# EAGLE design zegarek_v1.1 (EAGLE 6.2)
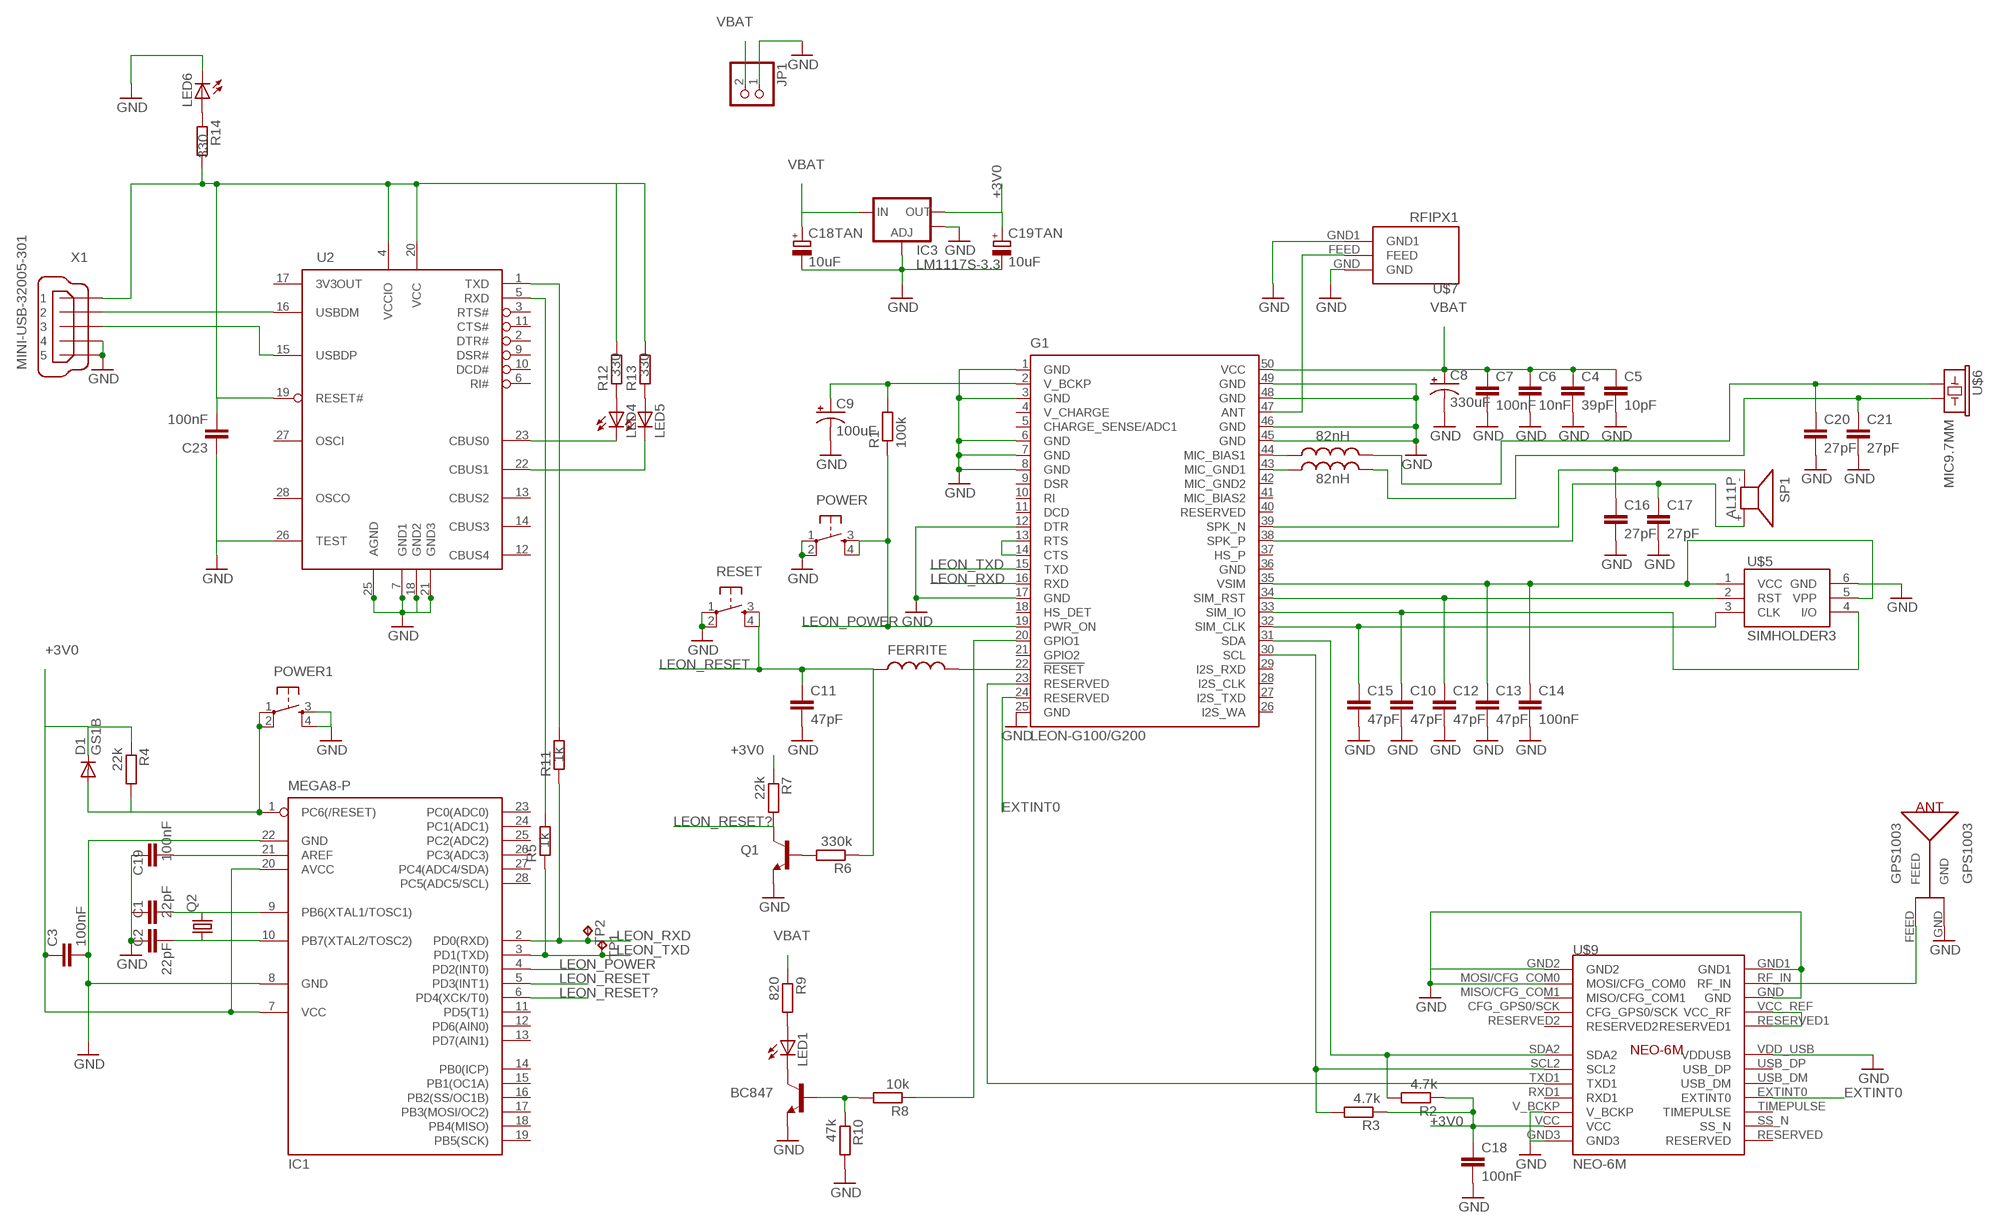
[diagram p0: schematic, sheet 1]

## Parts
BC847  TRANSISTOR_NPNSOT23  [SOT23]
C1  22pF  C-EUC0805  [C0805]
C2  22pF  C-EUC0805  [C0805]
C3  100nF  C-EUC0805  [C0805]
C4  39pF  C-EUC0805  [C0805]
C5  10pF  C-EUC0805  [C0805]
C6  10nF  C-EUC0805  [C0805]
C7  100nF  C-EUC0805  [C0805]
C8  330uF  CPOL-USUD-6,3X5,8  [UD-6,3X5,8_NICHICON]
C9  100uF  CPOL-USUD-6,3X5,8  [UD-6,3X5,8_NICHICON]
C10  47pF  C-EUC0805  [C0805]
C11  47pF  C-EUC0805  [C0805]
C12  47pF  C-EUC0805  [C0805]
C13  47pF  C-EUC0805  [C0805]
C14  100nF  C-EUC0805  [C0805]
C15  47pF  C-EUC0805  [C0805]
C16  27pF  C-EUC0805  [C0805]
C17  27pF  C-EUC0805  [C0805]
C18  100nF  C-EUC0805  [C0805]
C18TAN  10uF  CPOL-EUSMCA  [SMC_A]
C19  100nF  C-EUC0805  [C0805]
C19TAN  10uF  CPOL-EUSMCA  [SMC_A]
C20  27pF  C-EUC0805  [C0805]
C21  27pF  C-EUC0805  [C0805]
C23  100nF  C-EUC0805  [C0805]
D1  GS1B  DIODE-DO214AC  [DO214AC]
FERRITE  INDUCTOR0805  [0805]
FERRITE1  82nH  INDUCTOR0805  [0805]
FERRITE2  82nH  INDUCTOR0805  [0805]
G1  LEON-G100/G200  [LEON-G100/G200]
GPS1003  GPS1003  [GPS1003]
IC1  MEGA8-P  [DIL28-3]
IC3  LM1117S-3.3  V_REG_LM1117SOT223  [SOT223]
JP1  PINHD-1X2  [1X02]
LED1  LEDSMT1206  [1206]
LED4  LEDSMT1206  [1206]
LED5  LEDSMT1206  [1206]
LED6  LEDSMT1206  [1206]
POWER  TAC_SWITCHSMD  [TACTILE_SWITCH_SMD]
POWER1  TAC_SWITCHSMD  [TACTILE_SWITCH_SMD]
Q1  TRANSISTOR_NPNSOT23  [SOT23]
Q2  CRYSTALHC49S  [HC49/S]
R1  100k  R-EU_R0805  [R0805]
R2  4.7k  R-EU_R0805  [R0805]
R3  4.7k  R-EU_R0805  [R0805]
R4  22k  R-EU_R0805  [R0805]
R5  1k  R-EU_R0805  [R0805]
R6  330k  R-EU_R0805  [R0805]
R7  22k  R-EU_R0805  [R0805]
R8  10k  R-EU_R0805  [R0805]
R9  820  R-EU_R0805  [R0805]
R10  47k  R-EU_R0805  [R0805]
R11  1k  R-EU_R0805  [R0805]
R12  330  R-EU_R0805  [R0805]
R13  330  R-EU_R0805  [R0805]
R14  330  R-EU_R0805  [R0805]
RESET  TAC_SWITCHSMD  [TACTILE_SWITCH_SMD]
SP1  AL11P  [AL11P]
TP1  TPTP13R  [TP13R]
TP2  TPTP13R  [TP13R]
U2  FT232RL  [SSOP28DB]
U$5  SIMHOLDER3  [SIMHOLDER3]
U$6  MIC9.7MM  [MIC-9.7MM]
U$7  RFIPX1  [RF-IPX1]
U$9  NEO-6M  [NEO-6M]
X1  MINI-USB-32005-301  [32005-301]

## Nets
+3V0: C3.1 C18.1 C19TAN.+ D1.C IC1.7(VCC) IC1.20(AVCC) IC3.2(OUT) R2.1 R3.1 R4.1 R7.1 U$9.VCC
EXTINT0: G1.24(RESERVED) U$9.EXTINT0
GND: BC847.2(E) C1.1 C2.1 C3.2 C4.2 C5.2 C6.2 C7.2 C8.- C9.- C10.2 C11.2 C12.2 C13.2 C14.2 C15.2 C16.2 C17.2 C18.2 C18TAN.- C19.2 C19TAN.- C20.2 C21.2 C23.1 G1.1(GND) G1.3(GND) G1.6(GND) G1.7(GND) G1.8(GND) G1.12(DTR) G1.17(GND) G1.25(GND) G1.45(GND) G1.46(GND) G1.48(GND) G1.49(GND) GPS1003.GND IC1.8(GND) IC1.22(GND) IC3.1(ADJ) IC3.4(OUT) JP1.1 LED6.C POWER1.3 POWER1.4 POWER.1 POWER.2 Q1.2(E) R10.2 RESET.1 RESET.2 U2.7(GND1) U2.18(GND2) U2.21(GND3) U2.25(AGND) U2.26(TEST) U$5.6(GND) U$7.GND U$7.GND1 U$9.GND U$9.GND1 U$9.GND2 U$9.GND3 U$9.MOSI/CFG_COM0 U$9.V_BCKP U$9.VDD_USB(VDDUSB) X1.4 X1.5
LEON_POWER: G1.19(PWR_ON) IC1.4(PD2(INT0)) POWER.3 POWER.4 R1.1
LEON_RESET: C11.1 FERRITE.1 IC1.5(PD3(INT1)) R6.1 RESET.3 RESET.4
LEON_RESET?: IC1.6(PD4(XCK/T0)) Q1.3(C) R7.2
LEON_RXD: G1.16(RXD) IC1.2(PD0(RXD)) R11.1 TP2.TP
LEON_TXD: G1.15(TXD) IC1.3(PD1(TXD)) R5.1 TP1.TP
N$1: FERRITE.2 G1.22(!RESET)
N$2: C1.2 IC1.9(PB6(XTAL1/TOSC1)) Q2.2
N$3: C9.+ G1.2(V_BCKP) R1.2
N$4: C13.1 C14.1 G1.35(VSIM) U$5.1(VCC) U$5.5(VPP)
N$5: C15.1 G1.32(SIM_CLK) U$5.3(CLK)
N$6: C12.1 G1.34(SIM_RST) U$5.2(RST)
N$7: C16.1 G1.39(SPK_N) SP1.-
N$8: C10.1 G1.33(SIM_IO) U$5.4(I/O)
N$9: C17.1 G1.38(SPK_P) SP1.+
N$10: G1.13(RTS) G1.14(CTS)
N$11: FERRITE1.1 G1.44(MIC_BIAS1)
N$12: FERRITE2.1 G1.43(MIC_GND1)
N$13: C20.1 FERRITE1.2 U$6.1
N$14: C21.1 FERRITE2.2 U$6.2
N$15: Q1.1(B) R6.2
N$16: BC847.1(B) R8.2 R10.1
N$17: LED1.A R9.2
N$18: BC847.3(C) LED1.C
N$19: G1.20(GPIO1) R8.1
N$20: G1.47(ANT) U$7.FEED
N$21: C2.2 IC1.10(PB7(XTAL2/TOSC2)) Q2.1
N$23: GPS1003.FEED U$9.RF_IN
N$24: G1.31(SDA) R2.2 U$9.SDA2
N$25: U$9.RESERVED1 U$9.VCC_REF(VCC_RF)
N$26: G1.30(SCL) R3.2 U$9.SCL2
N$27: G1.23(RESERVED) U$9.TXD1
N$29: D1.A IC1.1(PC6(/RESET)) POWER1.1 POWER1.2 R4.2
N$30: C19.1 IC1.21(AREF)
N$31: LED4.A R12.1
N$32: LED5.A R13.1
N$33: LED4.C U2.23(CBUS0)
N$34: LED5.C U2.22(CBUS1)
N$35: R11.2 U2.1(TXD)
N$36: R5.2 U2.5(RXD)
N$47: C23.2 R12.2 R13.2 R14.2 U2.4(VCCIO) U2.19(RESET#) U2.20(VCC) X1.1
N$48: U2.16(USBDM) X1.2
N$49: U2.15(USBDP) X1.3
N$51: LED6.A R14.1
VBAT: C4.1 C5.1 C6.1 C7.1 C8.+ C18TAN.+ G1.50(VCC) IC3.3(IN) JP1.2 R9.1
Unconnected: G1.4(V_CHARGE) G1.5(CHARGE_SENSE/ADC1) G1.9(DSR) G1.10(RI) G1.11(DCD) G1.18(HS_DET) G1.21(GPIO2) G1.26(I2S_WA) G1.27(I2S_TXD) G1.28(I2S_CLK) G1.29(I2S_RXD) G1.37(HS_P) G1.40(RESERVED) G1.41(MIC_BIAS2) G1.42(MIC_GND2) IC1.11(PD5(T1)) IC1.12(PD6(AIN0)) IC1.13(PD7(AIN1)) IC1.14(PB0(ICP)) IC1.15(PB1(OC1A)) IC1.16(PB2(SS/OC1B)) IC1.17(PB3(MOSI/OC2)) IC1.18(PB4(MISO)) IC1.19(PB5(SCK)) IC1.23(PC0(ADC0)) IC1.24(PC1(ADC1)) IC1.25(PC2(ADC2)) IC1.26(PC3(ADC3)) IC1.27(PC4(ADC4/SDA)) IC1.28(PC5(ADC5/SCL)) U2.2(DTR#) U2.3(RTS#) U2.6(RI#) U2.9(DSR#) U2.10(DCD#) U2.11(CTS#) U2.12(CBUS4) U2.13(CBUS2) U2.14(CBUS3) U2.17(3V3OUT) U2.27(OSCI) U2.28(OSCO) U$9.CFG_GPS0/SCK U$9.MISO/CFG_COM1 U$9.RESERVED U$9.RESERVED2 U$9.RXD1 U$9.SS_N U$9.TIMEPULSE U$9.USB_DM U$9.USB_DP

## Power pins joined to a net without a drawn wire
GND: G1.36(GND)

## Library data of the parts
BC847 Q1 = SparkFun:TRANSISTOR_NPN: Transistor NPN BJT configuration in SOT23 package. MMBT2222 is the common NPN we use. Double check BCE configuration again layout.
C1-C7 C10-C21 C23 = rcl:C-EU: CAPACITOR, European symbol
C8 C9 = rcl:CPOL-US: POLARIZED CAPACITOR, American symbol
C18TAN C19TAN = rcl:CPOL-EU: POLARIZED CAPACITOR, European symbol
D1 = diode:DIODE-: DIODE
FERRITE FERRITE1 FERRITE2 = SparkFun:INDUCTOR: Inductors Basic Inductor/Choke - 0603 and 1206. Footprints are not proven and vary greatly between part numbers.
G1 = u-blox-1:LEON-G100/G200: LEON-G100/G200 Quad Band GSM/GPRS Voice and Data Modules Source: http://www.u-blox.com; OC_FARNELL: unknown; OC_NEWARK: unknown
GPS1003 = u-blox_NEO-6M:GPS1003
IC1 = atmel:MEGA8-P: MICROCONTROLLER 8 Kbytes FLASH, 1 kbytes SRAM, 512 bytes EEPROM, USART, 4-channel 10 bit ADC, 2-channel 8 bit ADC Pin compatible with Atmega48, ATMega88, ATMega168 Source: avr.lbr; OC_FARNELL: unknown; OC_NEWARK: unknown
IC3 = SparkFun:V_REG_LM1117: Voltage Regulator LM1117 Standard adjustable voltage regulator but in SMD form. Spark Fun Electronics SKU : COM-00595
JP1 = pinhead:PINHD-1X2: PIN HEADER
LED1 LED4-LED6 = led:LED: LED OSRAM: - CHIPLED LG R971, LG N971, LY N971, LG Q971, LY Q971, LO R971, LY R971 LH N974, LH R974 LS Q976, LO Q976, LY Q976 LO Q996 - Hyper CHIPLED LW Q18S LB Q993, LB Q99A, LB R99A - SideLED LS A670, LO A670, LY A670, LG A670, LP A670 LB A673, LV A673, LT A673, LW A673 LH A674 LY A675 LS A676, LA A676, LO A676, LY A676, LW A676 LS A679, LY A679, LG A679 - Hyper Micro SIDELED® LS Y876, LA Y876, LO Y876, LY Y876 LT Y87S - SmartLED LW L88C, LW L88S LB L89C, LB L89S, LG L890 LS L89K, LO L89K, LY L89K LS L896, LA L896, LO L896, LY L896 - TOPLED LS T670, LO T670, LY T670, LG T670, LP T670 LSG T670, LSP T670, LSY T670, LOP T670, LYG T670 LG T671, LOG T671, LSG T671 LB T673, LV T673, LT T673, LW T673 LH T674 LS T676, LA T676, LO T676, LY T676, LB T676, LH T676, LSB T676, LW T676 LB T67C, LV T67C, LT T67C, LS T67K, LO T67K, LY T67K, LW E67C LS E67B, LA E67B, LO E67B, LY E67B, LB E67C, LV E67C, LT E67C LW T67C LS T679, LY T679, LG T679 LS T770, LO T770, LY T770, LG T770, LP T770 LB T773, LV T773, LT T773, LW T773 LH T774 LS E675, LA E675, LY E675, LS T675 LS T776, LA T776, LO T776, LY T776, LB T776 LHGB T686 LT T68C, LB T68C - Hyper Mini TOPLED® LB M676 - Mini TOPLED Santana® LG M470 LS M47K, LO M47K, LY M47K Source: http://www.osram.convergy.de LUXEON: - LUMILED® LXK2-PW12-R00, LXK2-PW12-S00, LXK2-PW14-U00, LXK2-PW14-V00 LXK2-PM12-R00, LXK2-PM12-S00, LXK2-PM14-U00 LXK2-PE12-Q00, LXK2-PE12-R00, LXK2-PE12-S00, LXK2-PE14-T00, LXK2-PE14-U00 LXK2-PB12-K00, LXK2-PB12-L00, LXK2-PB12-M00, LXK2-PB14-N00, LXK2-PB14-P00, LXK2-PB14-Q00 LXK2-PR12-L00, LXK2-PR12-M00, LXK2-PR14-Q00, LXK2-PR14-R00 LXK2-PD12-Q00, LXK2-PD12-R00, LXK2-PD12-S00 LXK2-PH12-R00, LXK2-PH12-S00 LXK2-PL12-P00, LXK2-PL12-Q00, LXK2-PL12-R00 Source: www.luxeon.com KINGBRIGHT: KA-3528ASYC Source: www.kingbright.com
POWER POWER1 RESET = SparkFun:TAC_SWITCH: Momentary Switch Button commonly used for reset or general input. Spark Fun Electronics SKU : COM-00097
Q2 = crystal:CRYSTAL: CRYSTAL; OC_FARNELL: 1667008; OC_NEWARK: unknown
R1-R14 = rcl:R-EU_: RESISTOR, European symbol
SP1 = buzzer:AL11P: SPEAKER Source: Buerklin; OC_FARNELL: unknown; OC_NEWARK: unknown
TP1 TP2 = testpad:TP: Test pad
U2 = ftdichip-5:FT232RL: USB UART 4th Generation USB UART (USB <-> Serial) Controller
U$5 = SparkFun:SIMHOLDER3
U$6 = SparkFun:MIC: Microphone Omni-directional electret microphone. 9.7mm standard diameter.
U$7 = RFIPX:RFIPX1
U$9 = u-blox_NEO-6M:NEO-6M
X1 = con-cypressindustries:MINI-USB-: MINI USB-B Conector Source: www.cypressindustries.com; OC_FARNELL: unknown; OC_NEWARK: unknown

## Net classes
0 default: width 0.203 mm

## Board
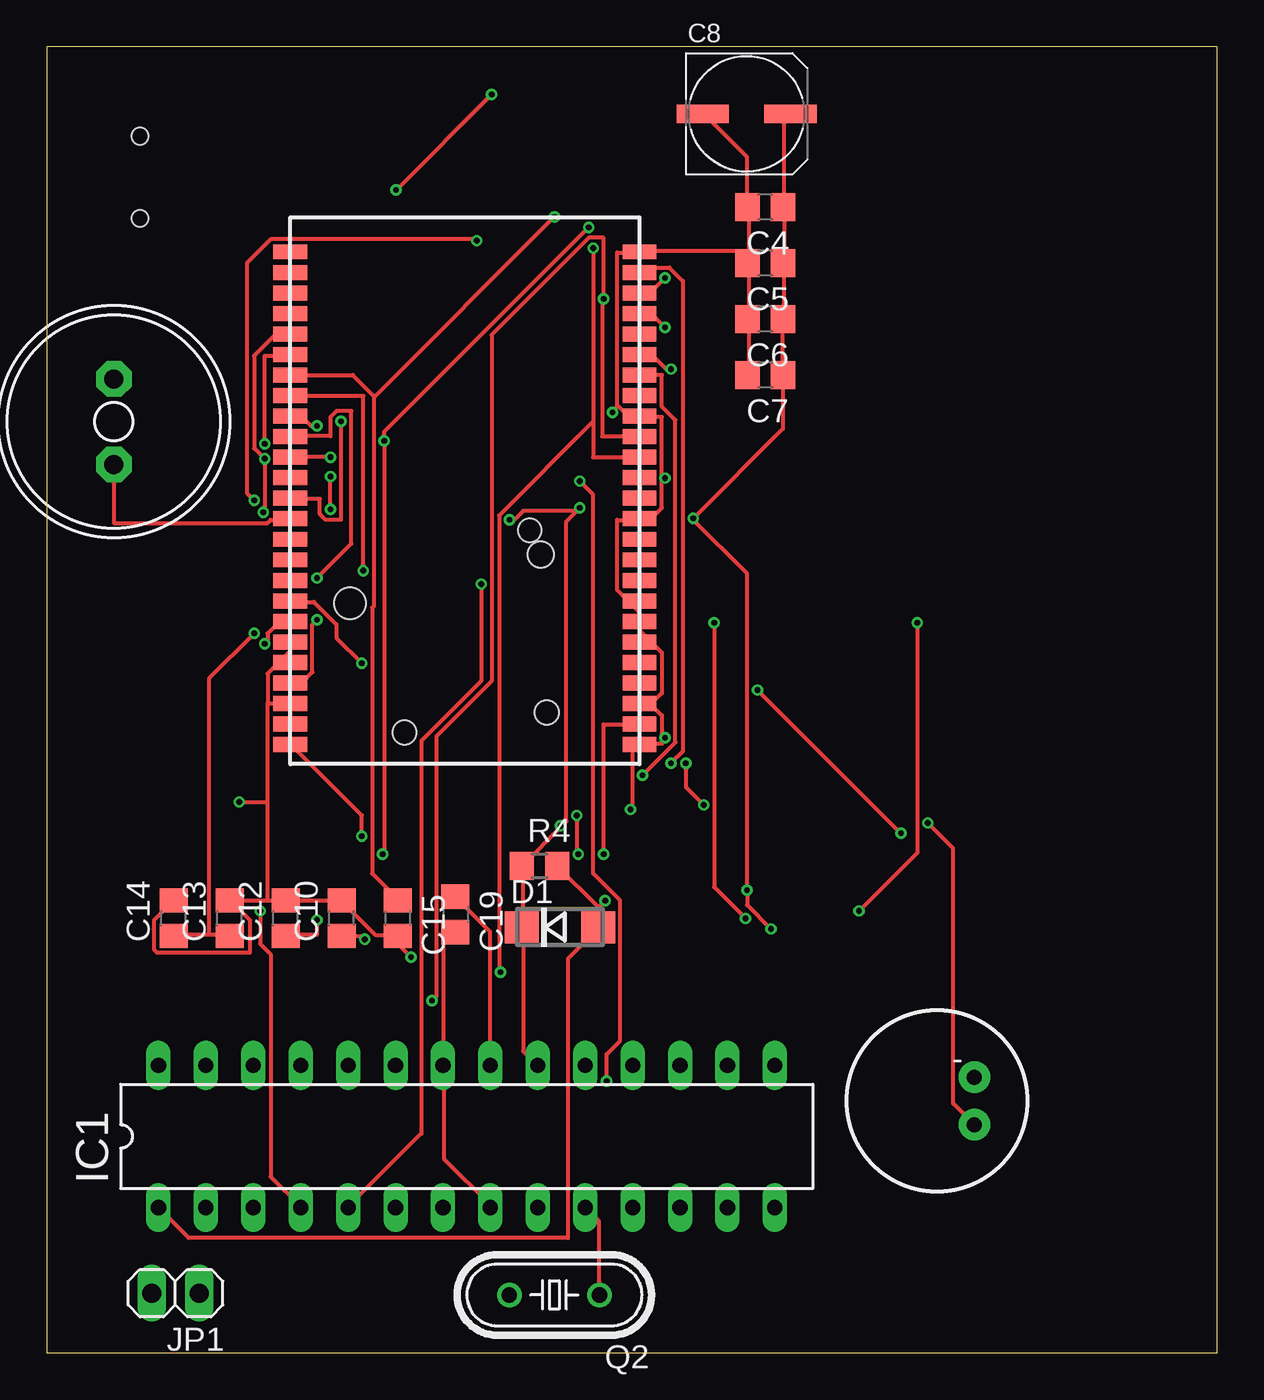
[diagram p1: board, top side]
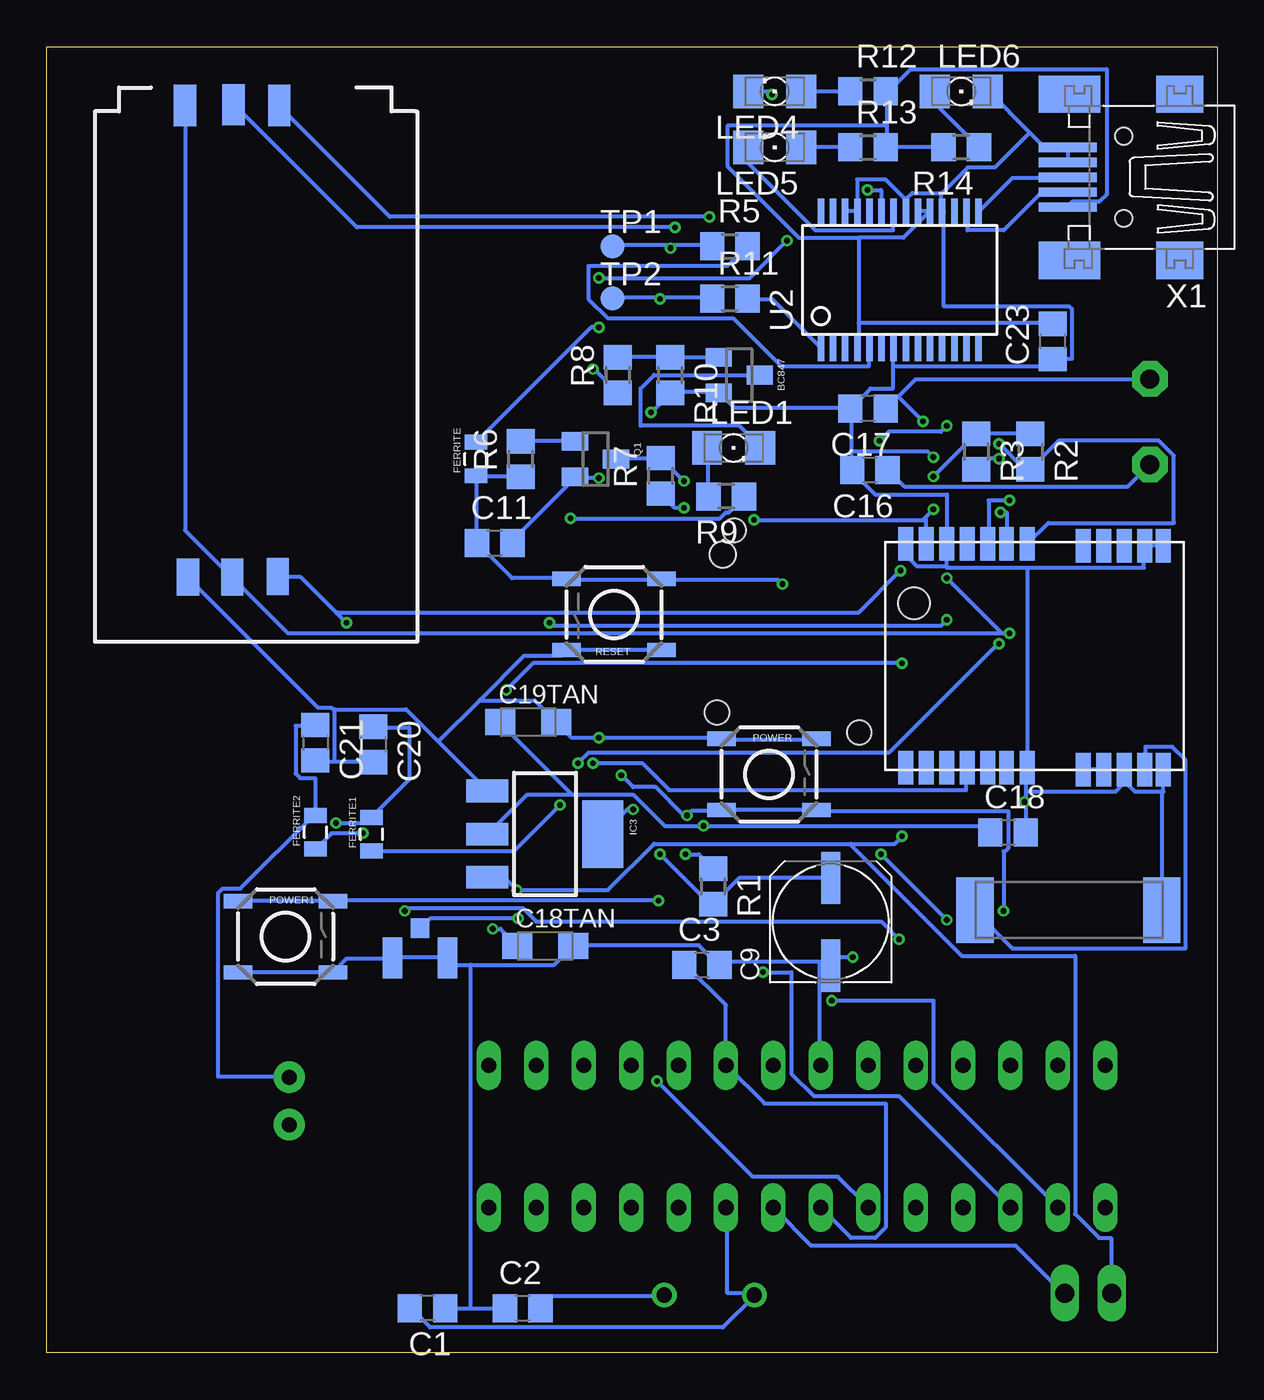
[diagram p2: board, bottom side, seen from below]

Size 62.7 x 70 mm. Coordinates in mm from the lower left corner, seen from the top.
Outline: 0,0 62.7,0 62.7,70 0,70 0,0
Copper layers (1*16): Top 0.035mm / dielectric 1.5mm / Bottom 0.035mm
Design rules: minimum track width 6mil, minimum drill 12mil, track to track 6mil, track to pad 6mil, pad to pad 6mil, via to via 6mil, smd to smd 0mil, copper to edge 10mil, drill to drill 10mil, minimum pad ring 10mil, minimum via ring 6mil, stop-mask expansion 2mil, vias tented up to drill 100mil, thermal gap 10mil

### Footprints (pad centres in the part's own frame; a part is rotated, then mirrored left to right if it is on the bottom)
SOT23 = smd 1 x 1.4: 1 -0.95,-1.1; 2 0.95,-1.1; 3 0,1.1
C0805 = smd 1.3 x 1.5: 1 -0.95,0; 2 0.95,0
UD-6,3X5,8_NICHICON = smd 2.8 x 1: + 2.35,0; - -2.35,0
SMC_A = smd 1.6 x 1.4: + -1.5,0; - 1.5,0
DO214AC = smd 1.8 x 1.7: A 2.05,0; C -2.05,0
0805 = smd 0.8 x 1.2: 1 -0.9,0; 2 0.9,0
LEON-G100/G200 = smd 1.8 x 0.8: 1 -9.35,13.6; 2 -9.35,12.5; 3 -9.35,11.4; 4 -9.35,10.3; 5 -9.35,9.2; 6 -9.35,8.1; 7 -9.35,7; 8 -9.35,5.9; 9 -9.35,4.8; 10 -9.35,3.7; 11 -9.35,2.6; 12 -9.35,1.5; 13 -9.35,0.4; 14 -9.35,-0.7; 15 -9.35,-1.8; 16 -9.35,-2.9; 17 -9.35,-4; 18 -9.35,-5.1; 19 -9.35,-6.2; 20 -9.35,-7.3; 21 -9.35,-8.4; 22 -9.35,-9.5; 23 -9.35,-10.6; 24 -9.35,-11.7; 25 -9.35,-12.8; 26 9.35,-12.8; 27 9.35,-11.7; 28 9.35,-10.6; 29 9.35,-9.5; 30 9.35,-8.4; 31 9.35,-7.3; 32 9.35,-6.2; 33 9.35,-5.1; 34 9.35,-4; 35 9.35,-2.9; 36 9.35,-1.8; 37 9.35,-0.7; 38 9.35,0.4; 39 9.35,1.5; 40 9.35,2.6; 41 9.35,3.7; 42 9.35,4.8; 43 9.35,5.9; 44 9.35,7; 45 9.35,8.1; 46 9.35,9.2; 47 9.35,10.3; 48 9.35,11.4; 49 9.35,12.5; 50 9.35,13.6 | hole 1.31: -4.39,11.88 | hole 1.29: 3.23,12.96 | hole 1.7: 6.16,6.02 | hole 1.4: -4.07,3.42 | hole 1.24: -3.47,2.12
GPS1003 = smd 3.5 x 2: FEED 0.23,4.96; GND 0.23,-5.04
DIL28-3 = drill 0.813 long: 1 -16.51,-3.81; 2 -13.97,-3.81; 3 -11.43,-3.81; 4 -8.89,-3.81; 5 -6.35,-3.81; 6 -3.81,-3.81; 7 -1.27,-3.81; 8 1.27,-3.81; 9 3.81,-3.81; 10 6.35,-3.81; 11 8.89,-3.81; 12 11.43,-3.81; 13 13.97,-3.81; 14 16.51,-3.81; 15 16.51,3.81; 16 13.97,3.81; 17 11.43,3.81; 18 8.89,3.81; 19 6.35,3.81; 20 3.81,3.81; 21 1.27,3.81; 22 -1.27,3.81; 23 -3.81,3.81; 24 -6.35,3.81; 25 -8.89,3.81; 26 -11.43,3.81; 27 -13.97,3.81; 28 -16.51,3.81
SOT223 = smd 1.219 x 2.235: 1 -2.311,-3.099; 2 0,-3.099; 3 2.311,-3.099 | smd 3.6 x 2.2: 4 0,3.099
1X02 = drill 1.016 long: 1 -1.27,0; 2 1.27,0
1206 = smd 1.6 x 1.803: A -1.422,0; C 1.422,0
TACTILE_SWITCH_SMD = smd 1.524 x 0.762: 1 -2.54,1.905; 2 2.54,1.905; 3 -2.54,-1.905; 4 2.54,-1.905
HC49/S = drill 0.813: 1 -2.413,0; 2 2.413,0
R0805 = smd 1.3 x 1.5: 1 -0.95,0; 2 0.95,0
AL11P = drill 1.016 pad 1.905 octagon: + 2.286,0; - -2.286,0
TP13R = smd 1.3 x 1.3: TP 0,0
SSOP28DB = smd 0.348 x 1.397: 1 -4.225,-3.656; 2 -3.575,-3.656; 3 -2.925,-3.656; 4 -2.275,-3.656; 5 -1.625,-3.656; 6 -0.975,-3.656; 7 -0.325,-3.656; 8 0.325,-3.656; 9 0.975,-3.656; 10 1.625,-3.656; 11 2.275,-3.656; 12 2.925,-3.656; 13 3.575,-3.656; 14 4.225,-3.656; 15 4.225,3.656; 16 3.575,3.656; 17 2.925,3.656; 18 2.275,3.656; 19 1.625,3.656; 20 0.975,3.656; 21 0.325,3.656; 22 -0.325,3.656; 23 -0.975,3.656; 24 -1.625,3.656; 25 -2.275,3.656; 26 -2.925,3.656; 27 -3.575,3.656; 28 -4.225,3.656
SIMHOLDER3 = smd 2.2 x 1.2: 1 0.95,4.81; 2 0.91,7.41; 3 0.95,9.86 | smd 2 x 1.2: 4 26.2,9.78; 5 26.22,7.34; 6 26.22,4.98
MIC-9.7MM = drill 0.8 pad 1.676: 1 -2,1.27; 2 -2,-1.27
RF-IPX1 = smd 1 x 1.05: FEED 0,-1.05 | smd 1.05 x 2.2: GND 1.475,0.525; GND1 -1.475,0.525
NEO-6M = smd 0.8 x 1.8: CFG_GPS0/SCK -3.32,-6.15; EXTINT0 3.98,5.75; GND -4.42,5.85; GND1 -6.52,5.85; GND2 -6.52,-6.15; GND3 7.28,-6.25; MISO/CFG_COM1 -4.42,-6.15; MOSI/CFG_COM0 -5.52,-6.15; RESERVED 7.28,5.75; RESERVED1 -2.22,5.85; RESERVED2 -2.22,-6.15; RF_IN -5.52,5.85; RXD1 3.98,-6.25; SCL2 1.88,-6.25; SDA2 0.78,-6.25; SS_N 6.18,5.75; TIMEPULSE 5.08,5.75; TXD1 2.88,-6.25; USB_DM 2.88,5.75; USB_DP 1.88,5.75; V_BCKP 5.08,-6.25; VCC 6.18,-6.25; VCC_REF -3.32,5.85; VDD_USB 0.78,5.75
32005-301 = smd 3.1 x 0.5: 1 3,1.6; 2 3,0.8; 3 3,0; 4 3,-0.8; 5 3,-1.6 | smd 2.5 x 2: M1 -3,-4.45; M2 -3,4.45 | smd 3.3 x 2: M3 2.9,4.45; M4 2.9,-4.45 | hole 0.9: 0,2.2; 0,-2.2

### Placement (x,y rotation side)
BC847  25.6,52.4 270 bottom
C1  42.3,2.4 180 bottom
C2  37.2,2.4 0 bottom
C3  27.6,20.8 0 bottom
C4  38.5,61.4 180 top
C5  38.5,58.4 180 top
C6  38.5,55.4 180 top
C7  38.5,52.4 180 top
C8  37.5,66.4 0 top
C9  20.7,23.1 90 bottom
C10  15.8,23.3 90 top
C11  38.7,43.4 0 bottom
C12  12.8,23.3 90 top
C13  9.8,23.3 90 top
C14  6.8,23.3 90 top
C15  18.8,23.3 270 top
C16  18.6,47.3 180 bottom
C17  18.7,50.6 180 bottom
C18  11.2,27.9 0 bottom
C18TAN  36,21.8 0 bottom
C19  21.9,23.5 270 top
C19TAN  36.9,33.8 0 bottom
C20  45.2,32.6 270 bottom
C21  48.3,32.7 270 bottom
C23  8.8,54.2 90 bottom
D1  27.5,22.8 0 top
FERRITE  39.7,47.9 90 bottom
FERRITE1  45.3,27.8 90 bottom
FERRITE2  48.3,27.9 90 bottom
G1  22.4,46.2 180 top
GPS1003  8,23.5 90 bottom
IC1  22.5,11.6 0 top
IC3  36,27.8 270 bottom
JP1  6.9,3.2 180 top
LED1  25.9,48.5 0 bottom
LED4  23.7,67.6 180 bottom
LED5  23.7,64.6 180 bottom
LED6  13.7,67.6 0 bottom
POWER  24,31 0 bottom
POWER1  49.9,22.3 0 bottom
Q1  33.3,47.9 270 bottom
Q2  27.2,3.1 180 top
R1  27,25 270 bottom
R2  10,48.3 270 bottom
R3  12.9,48.3 270 bottom
R4  26.4,26.1 0 top
R5  26.1,59.3 0 bottom
R6  37.3,47.9 90 bottom
R7  29.8,47 90 bottom
R8  32.1,52.4 90 bottom
R9  26.3,45.9 180 bottom
R10  29.3,52.4 270 bottom
R11  26.1,56.5 0 bottom
R12  18.7,67.6 0 bottom
R13  18.7,64.6 0 bottom
R14  13.7,64.6 180 bottom
RESET  32.3,39.57 180 bottom
SP1  3.6,49.9 90 top
TP1  32.4,59.3 0 bottom
TP2  32.4,56.5 0 bottom
U2  17,57.5 0 bottom
U$5  60.1,67.8 270 bottom
U$6  47.7,13.5 180 top
U$7  42.7,21.7 180 bottom
U$9  9.4,37.1 180 bottom
X1  5,63 180 bottom

### Tracks (layer width: path | path; a pad name or v marks a point on that pad's centre or on a via)
+3V0  (via drill 0.3)
  Top 0.203: 27.56,28.2 25.52,26.16 R4.1 25.52,26.08 25.52,22.8 D1.C 25.52,22.72 25.52,16.16 26.24,15.44 IC1.20 | 27.56,28.2 27.84,28.48 27.84,44.56 v28.56,45.28 28.32,45.12 25.52,45.12 25.04,44.64 v24.8,44.64 | v15.2,45.2 v15.2,46.96 | v27.52,28.24 27.56,28.2
  Bottom 0.203: 34.64,29.92 36.96,29.92 39.04,27.84 IC3.2 | 34.64,29.92 31.28,29.92 29.6,28.24 v27.52,28.24 12.48,28.24 12.16,27.92 C18.1 | C19TAN.+ 38.4,33.76 34.64,30 34.64,29.92 | C3.1 28.48,20.8 26.32,18.64 26.32,15.44 IC1.20 26.24,15.36 24.24,13.36 17.76,13.36 17.76,6.72 18.32,6.16 19.6,6.16 IC1.7 | R2.1 10,49.28 12.88,49.28 R3.1 12.96,49.2 v15.2,46.96 | v28.56,45.28 29.04,45.28 29.76,46 R7.1 | v24.8,44.64 15.68,44.64 | 15.68,44.64 15.6,44.64 15.6,43.36 U$9.VCC | v15.2,45.2 15.68,44.72 15.68,44.64
EXTINT0  (via drill 0.3)
  Top 0.203: v33.44,31.6 34.08,32.24 34.08,57.44 33.36,58.16 31.76,58.16 31.76,57.92 G1.24
  Bottom 0.203: v33.44,31.6 30.8,31.6 29.36,30.16 13.44,30.16 13.44,31.28 U$9.EXTINT0
GND  (via drill 0.3)
  Top 0.203: C7.2 37.6,52.4 37.6,55.36 C6.2 37.6,55.44 37.6,58.32 C5.2 | 31.76,59.04 G1.25 | C5.2 37.6,58.4 37.6,61.36 C4.2 37.52,61.44 37.52,64.08 35.2,66.4 C8.- | G1.25 31.84,59.04 37.52,59.04 C5.2 | 32.96,32.96 32.96,34.16 32.32,34.8 G1.3 32.4,34.8 32.96,35.36 32.96,37.52 31.84,38.64 31.76,38.64 | 32.96,32.96 32.96,32.64 31.76,32.64 G1.1 31.68,32.56 31.36,32.24 31.36,29.2 v31.28,29.12 | 31.76,50.24 G1.17 | 31.76,40.32 G1.8 31.76,40.24 31.76,39.76 | 31.76,38.08 G1.6 31.76,38.16 31.76,38.64 | 31.76,38.64 G1.7 31.76,39.28 31.76,39.76 | 31.76,39.76 31.68,39.76 30.56,40.88 30.56,44.64 31.68,44.64 G1.12 31.84,44.72 32.4,44.72 32.96,45.28 32.96,46.88 | 32.96,46.88 32.96,50.16 31.84,50.16 G1.17 | v33.12,46.88 32.96,46.88 | 30.56,50.8 30.56,58.96 31.68,58.96 G1.25 | 30.56,50.8 31.12,50.24 31.68,50.24 G1.17 | v33.12,32.96 32.96,32.96 | 23.76,7.84 IC1.8 23.76,7.92 21.28,10.4 21.28,15.36 IC1.22 21.28,15.44 21.28,21.92 21.84,22.48 C19.2 | G1.49 13.04,33.76 G1.48 11.84,34.8 | 13.04,37.04 G1.46 13.04,37.12 13.04,37.52 | 13.04,37.52 13.04,38.08 G1.45 | 11.84,34.8 11.84,36.4 12.96,37.52 13.04,37.52 | C14.2 5.76,23.2 5.76,21.6 5.92,21.44 10.88,21.44 10.88,23.2 9.84,24.24 C13.2 9.92,24.24 11.84,24.24 | 11.84,24.24 C12.2 12.88,24.24 15.76,24.24 C10.2 15.84,24.16 17.6,22.4 18.8,22.4 C15.2 18.88,22.32 18.88,21.84 v19.52,21.2 | 11.84,24.24 11.84,29.52 | 11.84,29.52 11.84,34.8 | v15.2,48 G1.36 | v10.32,29.52 11.84,29.52 | v30.32,50.4 30.32,50.48 30.56,50.72 30.56,50.8
  Bottom 0.203: POWER.2 21.52,32.88 26.48,32.88 POWER.1 26.56,32.96 v33.12,32.96 34.56,32.96 C19TAN.- 36.56,34.96 39.44,34.96 39.48,35 | RESET.1 29.84,37.68 34.8,37.68 RESET.2 34.88,37.6 35.12,37.36 37.12,37.36 39.48,35 | 47.28,31.68 48.24,31.68 C21.2 | 47.28,31.68 45.2,31.68 C20.2 | 47.32,34.44 47.28,34.4 47.28,31.68 | 47.32,34.44 47.44,34.56 48.16,34.56 55.12,41.52 U$5.6 | 41.72,32.76 43.44,34.48 47.28,34.48 47.32,34.44 | 41.72,32.76 39.12,30.16 IC3.1 | 41.72,32.76 39.48,35 | C11.2 37.68,43.44 37.68,43.6 34.4,46.88 Q1.2 34.32,46.88 v33.12,46.88 | v31.28,29.12 31.6,29.12 32.88,27.84 IC3.4 | POWER1.3 52.4,20.4 47.44,20.4 POWER1.4 46.64,21.12 44.24,21.12 U$7.GND 44.08,21.2 41.28,21.2 U$7.GND1 41.2,21.12 40.88,20.8 40,20.8 | C1.1 40,2.4 | 40,2.4 C2.1 | 40,20.8 35.52,20.8 34.56,21.76 C18TAN.- 34.48,21.84 27.76,21.84 26.72,20.8 C3.2 26.48,20.96 21.28,20.96 | 40,20.8 40,2.4 | 21.28,20.96 20.88,20.96 20.72,20.8 C9.- 20.64,20.8 20.24,21.2 v19.52,21.2 | JP1.1 8.24,3.2 10.8,5.76 21.76,5.76 23.76,7.76 IC1.8 | 21.28,20.96 21.28,15.44 IC1.22 | U2.26 19.92,61.2 19.28,61.2 U2.25 19.28,61.28 19.28,62.88 17.76,62.88 16.72,61.84 U2.21 16.64,61.2 16.64,61.84 16.32,62.16 14.8,62.16 | 14.8,62.16 14.8,61.2 U2.18 14.64,61.12 14.64,56.08 7.92,56.08 7.76,55.92 7.76,53.28 8.72,53.28 C23.1 8.8,53.2 9.12,52.88 17.36,52.88 | 10.04,65.4 9.28,64.64 8,64.64 X1.5 X1.4 | 10.04,65.4 12.24,67.6 LED6.C | 10.04,65.4 11.92,63.52 13.36,63.52 14.72,62.16 14.8,62.16 | U$9.GND1 2.88,30.08 2.96,30.08 | 2.96,30.08 4.4,30.08 4.96,30.64 4.96,31.2 U$9.GND 4.96,30.56 5.44,30.08 10.24,30.08 | 10.24,30.08 10.24,31.28 U$9.VDD_USB 10.16,31.44 10.16,42.08
  Bottom 0.203: 10.24,30.08 10.24,29.52 | 10.24,29.52 10.24,27.92 C18.2 | 2.96,30.08 GPS1003.GND | U$9.GND2 2.88,43.28 3.84,43.28 U$9.MOSI/CFG_COM0 3.92,43.2 3.92,42.08 10.16,42.08 | 14.48,42.16 U$9.V_BCKP 14.48,46 18.32,46 19.52,47.2 C16.2 19.6,47.36 19.6,48.32 | 14.48,42.16 16.08,42.16 16.64,42.72 16.64,43.28 U$9.GND3 | 10.16,42.08 14.48,42.08 14.48,42.16 | 17.36,52.88 17.36,51.68 18.56,51.68 19.6,50.64 C17.2 | 17.36,52.88 17.36,53.84 U2.7 | 19.6,48.32 19.6,50.56 C17.2 | v15.2,48 15.52,48.32 19.6,48.32 | C17.2 19.68,50.64 25.84,50.64 26.64,51.44 BC847.2 26.72,51.52 29.28,51.52 R10.2 29.28,51.36 29.36,51.36 v30.32,50.4 | v10.32,29.52 10.24,29.52
LEON_POWER  (via drill 0.3)
  Top 0.203: v28.48,26.72 28.4,26.8 v28.4,28.8 | G1.19 32.96,52.4 32.96,50.72 33.68,50 33.68,32.72 v31.92,30.96 | v11.44,23.68 11.44,21.92 12,21.36 12,9.44 13.6,7.84 IC1.4
  Bottom 0.203: v28.48,26.72 27.76,26.72 27.04,26 R1.1 | v31.92,30.96 31.28,30.32 30.08,30.32 28.56,28.8 v28.4,28.8 28.16,29.04 26.56,29.04 POWER.3 26.48,29.12 21.52,29.12 POWER.4 21.44,29.04 11.2,29.04 11.2,27.04 11.36,26.88 11.44,26.88 v11.44,23.68
LEON_RESET  (via drill 0.3)
  Top 0.203: v23.28,41.2 23.28,36 20.08,32.8 20.08,11.76 16.16,7.84 IC1.5
  Bottom 0.203: R6.1 37.36,46.96 39.68,46.96 FERRITE.1 39.68,46.88 39.68,43.44 C11.1 39.6,43.36 37.76,41.52 34.88,41.52 RESET.4 34.8,41.44 29.84,41.44 RESET.3 29.68,41.44 23.52,41.44 v23.28,41.2
LEON_RESET?  (via drill 0.3)
  Top 0.203: v28.56,46.72 29.28,46 29.28,25.68 30.72,24.24 30.72,16.72 30,16 v30,14.56
  Bottom 0.203: Q1.3 32.16,47.92 29.84,47.92 R7.2 29.76,47.92 v28.56,46.72 | v30,14.56 24.88,9.44 20.32,9.44 18.72,7.84 IC1.6
LEON_RXD  (via drill 0.3)
  Top 0.203: G1.16 31.68,49.12 29.76,49.12 29.76,56.4 v29.84,56.48 29.84,59.76 29.04,59.76 23.84,54.56 23.84,36 20.88,33.04 20.88,19.12 v20.64,18.88
  Bottom 0.203: 29.84,56.56 27.12,56.56 R11.1 | 29.84,56.56 32.4,56.56 TP2.TP | v29.84,56.48 29.84,56.56 | v20.64,18.88 15.2,18.88 15.2,14.48 8.56,7.84 IC1.2
LEON_TXD  (via drill 0.3)
  Top 0.203: G1.15 29.28,48 29.28,49.84 | v29.28,59.2 29.28,49.84 | v24.32,20.4 24.24,20.48 24.24,44.88 29.2,49.84 29.28,49.84
  Bottom 0.203: 29.28,59.36 27.12,59.36 R5.1 | 29.28,59.36 32.4,59.36 TP1.TP | v29.28,59.2 29.28,59.36 | IC1.3 17.04,13.76 21.6,13.76 22.8,14.96 22.8,20.4 v24.32,20.4
N$1  (via drill 0.3)
  Top 0.203: v33.12,54.96 32.4,55.68 31.76,55.68 G1.22
  Bottom 0.203: v33.12,54.96 33.52,54.96 39.68,48.8 FERRITE.2
N$2
  Bottom 0.203: C1.2 43.2,2.4 42.16,1.36 26.48,1.36 24.8,3.04 Q2.2 24.8,3.2 26.24,3.2 26.24,7.76 IC1.9
N$3  (via drill 0.3)
  Top 0.203: v29.84,26.72 29.84,33.68 31.68,33.68 G1.2
  Bottom 0.203: C9.+ 20.72,25.44 25.6,25.44 26.96,24.08 R1.2 27.04,24.08 27.2,24.08 v29.84,26.72
N$4  (via drill 0.3)
  Top 0.203: 8.72,22.4 9.76,22.4 C13.1 | 8.72,22.4 6.8,22.4 C14.1 | v14.48,41.52 16.32,43.36 16.32,50.48 15.52,50.48 15.2,50.16 15.2,49.12 13.12,49.12 G1.35 | v11.12,38.56 8.72,36.16 8.72,22.4
  Bottom 0.203: U$5.1 55.28,66.8 55.28,44.08 52.8,41.6 U$5.5 52.72,41.52 49.76,38.56 11.6,38.56 11.56,38.6 | 11.56,38.6 11.52,38.56 v11.12,38.56 | 11.56,38.6 v14.48,41.52
N$5  (via drill 0.3)
  Top 0.203: 17.52,51.28 17.52,40 17.44,39.92 17.44,25.68 18.8,24.32 C15.1 | 17.52,51.28 16.4,52.4 G1.32 | v27.2,60.88 17.6,51.28 17.52,51.28
  Bottom 0.203: v27.2,60.88 44.32,60.88 50.24,66.8 U$5.3
N$6  (via drill 0.3)
  Top 0.203: v14.48,23.2 14.48,22.4 12.8,22.4 C12.1 | v18,26.72 18.08,26.8 v18.08,48.88 18.08,49.36 v29.04,60.32 | v14.48,49.68 14.16,49.68 13.68,50.16 13.12,50.16 G1.34
  Bottom 0.203: v18,26.72 v14.48,23.2 | v18.08,48.88 17.6,49.36 14.8,49.36 v14.48,49.68 | v29.04,60.32 46.08,60.32 52.64,66.88 U$5.2
N$7
  Top 0.203: SP1.- 3.6,44.48 11.84,44.48 12,44.64 13.04,44.64 G1.39
  Bottom 0.203: C16.1 17.6,47.28 16.72,46.4 4.8,46.4 SP1.-
N$8  (via drill 0.3)
  Top 0.203: v17.04,22.16 17.04,22.32 15.84,22.32 C10.1 | v43.52,23.68 46.64,26.8 v46.64,39.12 | v16.96,41.92 16.96,51.28 13.12,51.28 G1.33
  Bottom 0.203: v17.04,22.16 18,23.12 36.48,23.12 37.2,23.84 43.36,23.84 v43.52,23.68 | 47.16,39.64 49.12,41.6 U$5.4 | 47.16,39.64 v46.64,39.12 | v16.96,41.92 19.2,39.68 47.12,39.68 47.16,39.64
N$9  (via drill 0.3)
  Top 0.203: v15.76,49.92 15.76,44.64 14.96,44.64 14.64,44.96 14.64,45.76 13.12,45.76 G1.38
  Bottom 0.203: 17.08,51.24 16.16,52.16 3.6,52.16 SP1.+ | 17.08,51.24 17.68,50.64 C17.1 | 17.08,51.24 v15.76,49.92
N$10
  Top 0.203: G1.13 31.76,45.84 31.76,46.88 G1.14
N$11  (via drill 0.3)
  Top 0.203: v35.2,29.36 34.24,30.32 v34.24,31.6 | v11.68,38 11.84,38.16 11.84,38.56 12.48,39.2 G1.44
  Bottom 0.203: v35.2,29.36 37.68,26.88 45.28,26.88 FERRITE1.1 | v34.24,31.6 33.68,32.16 17.6,32.16 11.76,38 v11.68,38
N$12  (via drill 0.3)
  Top 0.203: v38.08,35.52 v45.76,27.84 | v16.88,36.96 15.52,38.32 15.52,39.04 14.32,40.24 13.12,40.24 G1.43
  Bottom 0.203: v45.76,27.84 47.44,27.84 48.24,27.04 FERRITE2.1 | v38.08,35.52 36.64,36.96 v16.88,36.96
N$13  (via drill 0.3)
  Top 0.203: v47.2,28.4 48.56,27.04 48.56,13.36 49.68,12.24 U$6.1
  Bottom 0.203: C20.1 45.2,33.52 43.28,33.52 43.28,30.72 FERRITE1.2 45.6,28.4 v47.2,28.4
N$14
  Bottom 0.203: C21.1 48.32,33.6 49.36,33.6 49.36,31.04 49.12,30.8 48.32,30.8 48.32,28.8 FERRITE2.2 48.4,28.8 52.32,24.88 53.28,24.88 53.52,24.64 53.52,14.8 49.76,14.8 U$6.2
N$15
  Bottom 0.203: Q1.1 34.4,48.88 37.28,48.88 R6.2
N$16
  Bottom 0.203: BC847.1 26.72,53.36 29.28,53.36 R10.1 29.36,53.36 32.08,53.36 R8.2
N$17
  Bottom 0.203: R9.2 27.28,45.92 27.28,48.48 LED1.A
N$18
  Bottom 0.203: BC847.3 30.16,52.4 30.88,51.68 30.88,49.68 25.6,49.68 24.48,48.56 LED1.C
N$19  (via drill 0.3)
  Top 0.203: v33.44,52.72 33.2,52.72 32.48,53.44 31.76,53.44 G1.20
  Bottom 0.203: v33.44,52.72 33.36,52.72 32.16,51.52 R8.1
N$20  (via drill 0.3)
  Top 0.203: v37.44,23.28 35.76,24.96 v35.76,39.12 | v14.48,39.28 14.24,39.04 14.24,36.48 13.68,35.92 13.12,35.92 G1.47
  Bottom 0.203: v37.44,23.28 42.16,23.28 42.64,22.8 U$7.FEED | v35.76,39.12 35.6,38.96 14.8,38.96 v14.48,39.28
N$21
  Top 0.203: IC1.10 29.6,7.04 29.6,3.12 Q2.1
  Bottom 0.203: C2.2 35.6,3.04 29.68,3.04 Q2.1
N$23
  Bottom 0.203: U$9.RF_IN 3.84,31.28 3.84,32.48 2.4,32.48 1.68,31.76 1.68,21.68 10.96,21.68 12.96,23.68 GPS1003.FEED
N$24  (via drill 0.3)
  Top 0.203: v11.68,48.72 11.68,53.44 13.04,53.44 G1.31
  Bottom 0.203: U$9.SDA2 10.16,43.36 9.04,44.48 2.32,44.48 2.32,48.08 3.12,48.88 8.48,48.88 R2.2 10.08,47.36 10.32,47.36 v11.68,48.72
N$25
  Bottom 0.203: U$9.VCC_REF 6.08,31.28 7.12,31.28 U$9.RESERVED1
N$26  (via drill 0.3)
  Top 0.203: G1.30 13.04,54.56 12.24,54.56 11.12,53.44 11.12,48.48 v11.68,47.92 11.68,45.12 v11.6,45.04
  Bottom 0.203: v11.68,47.92 12.32,47.92 12.88,47.36 R3.2 | U$9.SCL2 11.28,45.04 v11.6,45.04
N$27  (via drill 0.3)
  Top 0.203: v11.12,45.68 10.72,46.08 10.72,58.4 12,59.68 23.04,59.68 v23.04,59.6 | v33.12,57.6 32.32,56.8 G1.23
  Bottom 0.203: v11.12,45.68 12.24,45.68 12.24,43.36 U$9.TXD1 | v23.04,59.6 25.04,57.6 v33.12,57.6
N$29  (via drill 0.3)
  Top 0.203: 29.52,23.92 27.36,26.08 R4.2 | 29.52,23.92 29.52,22.8 D1.A 29.52,22.72 27.92,21.12 27.92,6.16 7.6,6.16 6,7.76 IC1.1 | v29.92,24.24 29.6,23.92 29.52,23.92
  Bottom 0.203: POWER1.1 52.4,24.24 47.36,24.24 POWER1.2 47.28,24.24 v29.92,24.24
N$30
  Top 0.203: C19.1 21.92,24.4 23.76,22.56 23.76,15.44 IC1.21
N$31
  Bottom 0.203: LED4.A R12.1
N$32
  Bottom 0.203: R13.1 19.68,64.64 22.24,64.64 LED5.A
N$33  (via drill 0.3)
  Top 0.203: v23.84,67.44 v18.72,62.32
  Bottom 0.203: v18.72,62.32 18,62.32 18,61.2 U2.23 | v23.84,67.44 24,67.6 LED4.C
N$34
  Bottom 0.203: U2.22 17.36,61.12 17.36,60.16 21.52,60.16 25.12,63.76 25.12,64.56 LED5.C
N$35
  Bottom 0.203: U2.1 21.28,53.92 23.84,56.48 25.12,56.48 R11.2
N$36
  Bottom 0.203: U2.5 18.64,53.84 18.64,52.88 23.36,52.88 25.92,55.44 32.64,55.44 33.68,56.48 33.68,58.24 26.24,58.24 25.2,59.28 R5.2
N$47
  Bottom 0.203: U2.20 16,61.2 15.44,61.2 U2.19 15.44,61.12 16.8,59.76 19.2,59.76 | 19.2,59.76 19.2,55.2 | 19.2,55.2 19.2,53.92 U2.4 | 19.2,55.2 8.8,55.2 C23.2 | R14.2 14.72,64.64 17.68,64.64 R13.2 17.68,64.72 17.68,65.76 | 17.68,65.76 17.68,67.6 R12.2 17.6,67.6 16.4,68.8 5.92,68.8 5.92,62.08 6.32,61.68 7.76,61.68 8,61.44 X1.1 | 19.2,59.76 22.4,59.76 26.24,63.6 26.24,65.76 17.68,65.76
N$48
  Bottom 0.203: U2.16 13.36,61.12 13.36,60.16 11.44,60.16 9.44,62.16 8,62.16 X1.2
N$49
  Bottom 0.203: U2.15 12.72,61.2 10.96,62.96 8,62.96 X1.3
N$51
  Bottom 0.203: R14.1 12.8,64.64 15.12,66.96 LED6.A
VBAT  (via drill 0.3)
  Top 0.203: C8.+ 39.52,66.08 39.52,61.44 C4.1 39.52,61.36 39.52,58.4 C5.1 39.52,58.32 39.52,55.44 C6.1 39.44,55.36 39.44,52.48 C7.1 39.44,49.52 v34.64,44.72 34.64,44.64 37.52,41.76 v37.52,24.8 37.52,24 v38.8,22.72 | v16.88,27.68 16.88,28.8 13.12,32.56 G1.50
  Bottom 0.203: v34.64,44.72 26.64,44.72 26.32,45.04 26.16,45.04 25.36,45.84 R9.1 | v38.8,22.72 38.4,22.72 37.52,21.84 C18TAN.+ | IC3.3 39.04,25.44 38.16,25.44 v37.52,24.8 32.64,24.8 30.16,27.28 19.6,27.28 | v16.88,27.68 17.28,27.28 19.6,27.28 | JP1.2 5.68,3.2 5.68,6.16 6.32,6.16 7.6,7.44 7.6,21.28 13.68,21.28 19.6,27.2 19.6,27.28